# EAGLE design Doorbell (EAGLE 6.2)

## Sheet 1 of 7
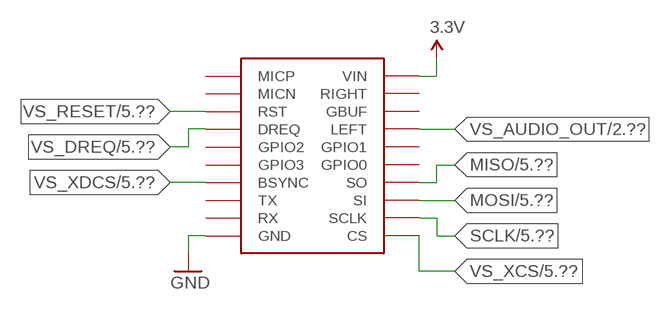
[diagram p0: schematic, sheet 1]

### Parts
U$3  VS1011E  [ADAFRUIT_1X10-BIG]

### Nets
3.3V: U$3.VIN ; also sheet 3,4,5,6,7
GND: U$3.GND ; also sheet 2,3,4,5,6,7
MISO: U$3.SO ; also sheet 5,6
MOSI: U$3.SI ; also sheet 5,6
SCLK: U$3.SCLK ; also sheet 5,6
VS_AUDIO_OUT: U$3.LEFT ; also sheet 2
VS_DREQ: U$3.DREQ ; also sheet 5
VS_RESET: U$3.RST ; also sheet 5
VS_XCS: U$3.CS ; also sheet 5
VS_XDCS: U$3.BSYNC ; also sheet 5
Unconnected: U$3.GBUF U$3.GPIO0 U$3.GPIO1 U$3.GPIO2 U$3.GPIO3 U$3.MICN U$3.MICP U$3.RIGHT U$3.RX U$3.TX

## Sheet 2 of 7
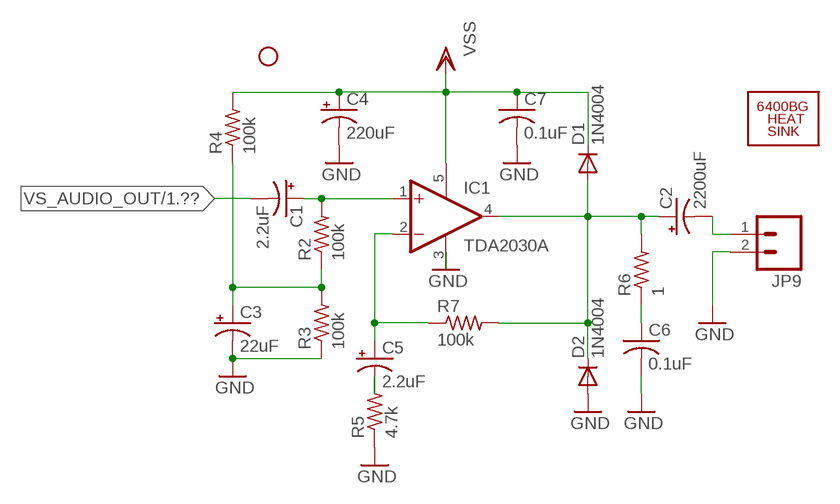
[diagram p1: schematic, sheet 2]

### Parts
C1  2.2uF  CPOL-USE2-5  [E2-5]
C2  2200uF  CPOL-USE7.5-16  [E7,5-16]
C3  22uF  CPOL-USE2-5  [E2-5]
C4  220uF  CPOL-USE5-10.5  [E5-10,5]
C5  2.2uF  CPOL-USE2-5  [E2-5]
C6  0.1uF  C-US025-030X050  [C025-030X050]
C7  0.1uF  C-US025-030X050  [C025-030X050]
D1  1N4004  [DO41-10]
D2  1N4004  [DO41-10]
IC1  TDA2030A  TDA2030V  [CB360]
JP7  STAND-OFF  [STAND-OFF]
JP9  M025MM  [SCREWTERMINAL-5MM-2]
R2  100k  R-US_0207/7  [0207/7]
R3  100k  R-US_0207/7  [0207/7]
R4  100k  R-US_0207/7  [0207/7]
R5  4.7k  R-US_0207/7  [0207/7]
R6  1  R-US_0207/7  [0207/7]
R7  100k  R-US_0207/7  [0207/7]
U$1  6400BG_HEATSINK  [6400BG_HEATSINK]

### Nets
GND: C3.- C4.- C6.2 C7.2 D2.A IC1.3(GND) JP9.2 R3.1 R5.1 ; also sheet 1,3,4,5,6,7
N$1: C6.1 R6.1
N$2: C2.+ D1.A D2.C IC1.4(OUT) R6.2 R7.2
N$3: C5.- R5.2
N$4: C5.+ IC1.2(-IN) R7.1
N$5: C1.+ IC1.1(+IN) R2.2
N$6: C3.+ R2.1 R3.2 R4.1
N$7: C2.- JP9.1
VS_AUDIO_OUT: C1.- ; also sheet 1
VSS: C4.+ C7.1 D1.C IC1.5(V+) R4.2 ; also sheet 3

## Sheet 3 of 7
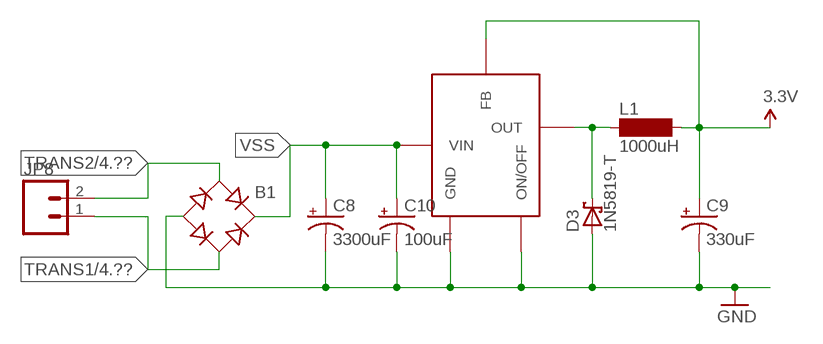
[diagram p2: schematic, sheet 3]

### Parts
B1  DBDB101G  [DB]
C8  3300uF  CPOL-USE7.5-18  [E7,5-18]
C9  330uF  CPOL-USE5-8.5  [E5-8,5]
C10  100uF  CPOL-USE5-8.5  [E5-8,5]
D3  1N5819-T  [DO41-7.6]
JP8  M025MM  [SCREWTERMINAL-5MM-2]
L1  1000uH  BS11  [BS11]
U$2  LM2575  [LINEAR-TECHNOLOGY_TO220-5]

### Nets
3.3V: C9.+ L1.2 U$2.FB ; also sheet 1,4,5,6,7
GND: B1.- C8.- C9.- C10.- D3.A U$2.GND U$2.ON/OFF ; also sheet 1,2,4,5,6,7
N$8: D3.C L1.1 U$2.OUT
TRANS1: B1.AC2 JP8.1 ; also sheet 4
TRANS2: B1.AC1 JP8.2 ; also sheet 4
VSS: B1.+ C8.+ C10.+ U$2.VIN ; also sheet 2

## Sheet 4 of 7
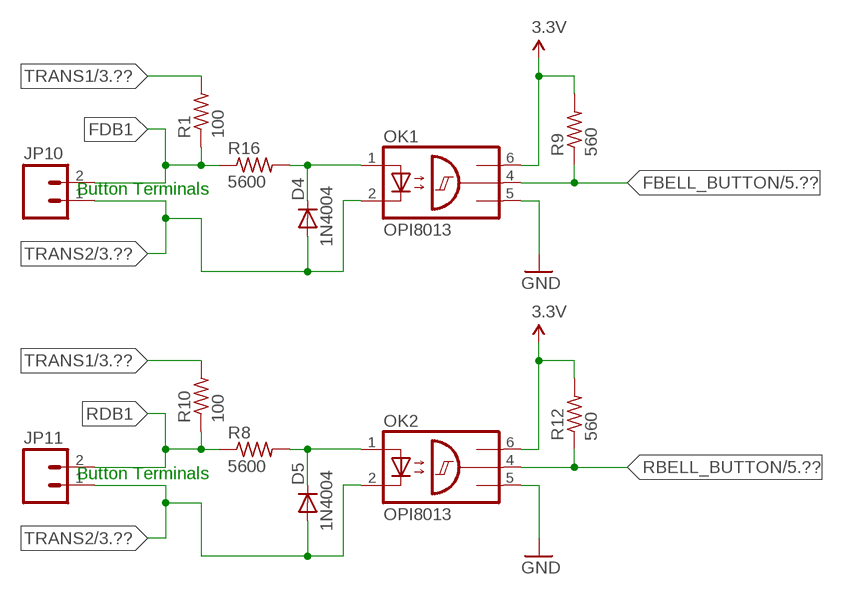
[diagram p3: schematic, sheet 4]

### Parts
D4  1N4004  [DO41-10]
D5  1N4004  [DO41-10]
JP10  M025MM  [SCREWTERMINAL-5MM-2]
JP11  M025MM  [SCREWTERMINAL-5MM-2]
OK1  OPI8013  [DIL06]
OK2  OPI8013  [DIL06]
R1  100  R-US_0817/22  [P0817/22]
R8  5600  R-US_0207/12  [0207/12]
R9  560  R-US_0207/7  [0207/7]
R10  100  R-US_0817/22  [P0817/22]
R12  560  R-US_0207/7  [0207/7]
R16  5600  R-US_0207/12  [0207/12]

### Nets
3.3V: OK1.6(VCC) OK2.6(VCC) R9.2 R12.2 ; also sheet 1,3,5,6,7
FBELL_BUTTON: OK1.4(OUT) R9.1 ; also sheet 5
FDB1: JP10.2 R1.1 R16.1
GND: OK1.5(GND) OK2.5(GND) ; also sheet 1,2,3,5,6,7
N$9: D4.C OK1.1(A) R16.2
N$10: D5.C OK2.1(A) R8.2
RBELL_BUTTON: OK2.4(OUT) R12.1 ; also sheet 5
RDB1: JP11.2 R8.1 R10.1
TRANS1: R1.2 R10.2 ; also sheet 3
TRANS2: D4.A D5.A JP10.1 JP11.1 OK1.2(C) OK2.2(C) ; also sheet 3

### Notes on the sheet
- Button Terminals
- Button Terminals

## Sheet 5 of 7
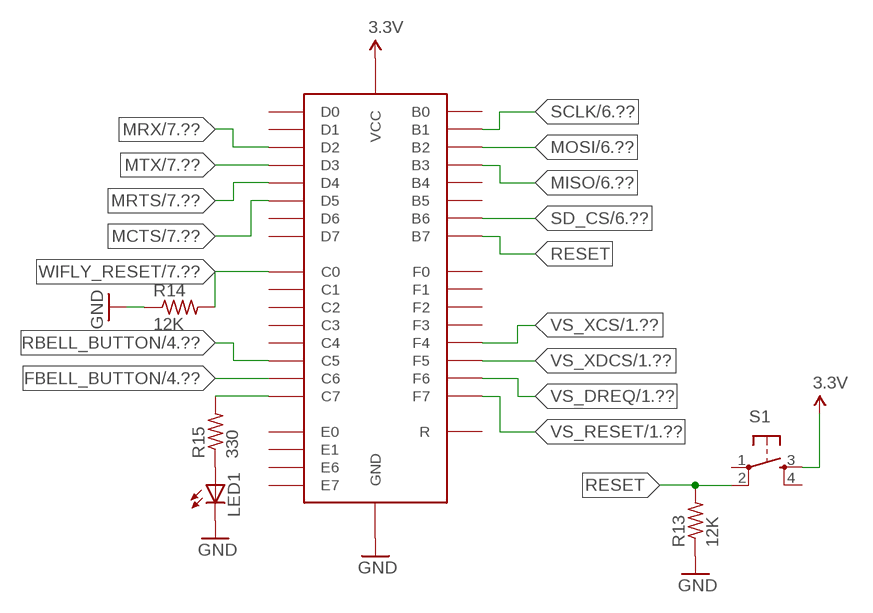
[diagram p4: schematic, sheet 5]

### Parts
LED1  LED3MM  [LED3MM]
R13  12K  R-US_0207/7  [0207/7]
R14  12K  R-US_0207/7  [0207/7]
R15  330  R-US_0207/7  [0207/7]
S1  TAC_SWITCHPTH  [TACTILE-PTH]
U$4  AT90USB1286AT90USB1286BREAKOUT  [ADAFRUIT_1X10-BIG]

### Nets
3.3V: S1.3 U$4.VCC ; also sheet 1,3,4,6,7
FBELL_BUTTON: U$4.C6 ; also sheet 4
GND: LED1.K(C) R13.1 R14.1 U$4.GND ; also sheet 1,2,3,4,6,7
MCTS: U$4.D5 ; also sheet 7
MISO: U$4.B3 ; also sheet 1,6
MOSI: U$4.B2 ; also sheet 1,6
MRTS: U$4.D4 ; also sheet 7
MRX: U$4.D2 ; also sheet 7
MTX: U$4.D3 ; also sheet 7
N$11: R15.2 U$4.C7
N$12: LED1.A R15.1
RBELL_BUTTON: U$4.C5 ; also sheet 4
RESET: R13.2 S1.2 U$4.B7
SCLK: U$4.B1 ; also sheet 1,6
SD_CS: U$4.B6 ; also sheet 6
VS_DREQ: U$4.F6 ; also sheet 1
VS_RESET: U$4.F7 ; also sheet 1
VS_XCS: U$4.F4 ; also sheet 1
VS_XDCS: U$4.F5 ; also sheet 1
WIFLY_RESET: R14.2 U$4.C0 ; also sheet 7
Unconnected: S1.1 S1.4 U$4.B0 U$4.B4 U$4.B5 U$4.C1 U$4.C2 U$4.C3 U$4.C4 U$4.D0 U$4.D1 U$4.D6 U$4.D7 U$4.E0 U$4.E1 U$4.E6 U$4.E7 U$4.F0 U$4.F1 U$4.F2 U$4.F3 U$4.R

## Sheet 6 of 7
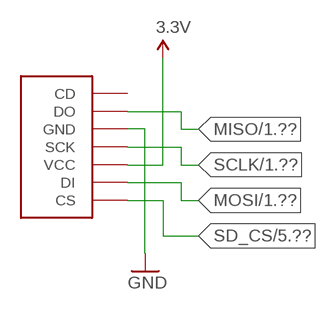
[diagram p5: schematic, sheet 6]

### Parts
U$5  MICROSDMICROSDBREAKOUT  [ADAFRUIT_1X08-BIG]

### Nets
3.3V: U$5.VCC ; also sheet 1,3,4,5,7
GND: U$5.GND ; also sheet 1,2,3,4,5,7
MISO: U$5.DO ; also sheet 1,5
MOSI: U$5.DI ; also sheet 1,5
SCLK: U$5.SCK ; also sheet 1,5
SD_CS: U$5.CS ; also sheet 5
Unconnected: U$5.CD

## Sheet 7 of 7
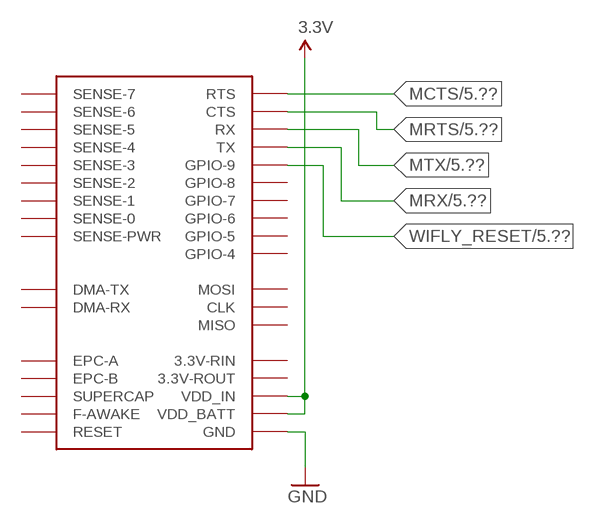
[diagram p6: schematic, sheet 7]

### Parts
U$6  WIFLY_BREAKOUT  [SPARKFUN_1X17]

### Nets
3.3V: U$6.VDD_BATT U$6.VDD_IN ; also sheet 1,3,4,5,6
GND: U$6.GND ; also sheet 1,2,3,4,5,6
MCTS: U$6.RTS ; also sheet 5
MRTS: U$6.CTS ; also sheet 5
MRX: U$6.TX ; also sheet 5
MTX: U$6.RX ; also sheet 5
WIFLY_RESET: U$6.GPIO-9 ; also sheet 5
Unconnected: U$6.3.3V-RIN U$6.3.3V-ROUT U$6.CLK U$6.DMA-RX U$6.DMA-TX U$6.EPC-A U$6.EPC-B U$6.F_AWAKE(F-AWAKE) U$6.GPIO-4 U$6.GPIO-5 U$6.GPIO-6 U$6.GPIO-7 U$6.GPIO-8 U$6.MISO U$6.MOSI U$6.RESET U$6.SENSE-0 U$6.SENSE-1 U$6.SENSE-2 U$6.SENSE-3 U$6.SENSE-4 U$6.SENSE-5 U$6.SENSE-6 U$6.SENSE-7 U$6.SENSE-PWR U$6.SUPERCAP

## Library data of the parts
B1 = rectifier:DB?*G: Single Phase 1.0 AMP Glass Passivated Bridge Rectifier Taiwan Semiconductor Co.,Ltd. - TSC Source: http://www.taiwansemi.com/TSCbig5/ezcatfiles/cust/img/img/db101g.pdf http://www.ts.com.tw/db/pictures/modules/PDT/PDT060207001/DBLS201G.pdf
C1-C5 C8-C10 = adafruit:CPOL-US: POLARIZED CAPACITOR, American symbol
C6 C7 = adafruit:C-US: CAPACITOR, American symbol
D1 D2 D4 D5 = adafruit:1N4004: DIODE General purpose 1N400x type rectifier (With bigger pads) http://www.ladyada.net/library/pcb/eaglelibrary.html
D3 = diode:1N581*: 1.0A SCHOTTKY BARRIER RECTIFIER Source: http://www.diodes.com/datasheets/ds23001.pdf
IC1 = Audio-Power-amlifier:TDA2030: Power OP AMP
JP7 = SparkFun-Electromechanical:STAND-OFF: #4 Stand Off This is the mechanical footprint for a #4 phillips button head screw. Use the keepout ring to avoid running the screw head into surrounding components. SKU : PRT-00447
JP8-JP11 = SparkFun-Connectors:M02: Header 2 Standard 2-pin 0.1" header. Use with straight break away headers (SKU : PRT-00116), right angle break away headers (PRT-00553), swiss pins (PRT-00743), machine pins (PRT-00117), and female headers (PRT-00115). Molex polarized connector foot print use with SKU : PRT-08233 with associated crimp pins and housings.
L1 = inductor-neosid:BS: INDUCTOR nominal inductance, magnetically screened; OC_FARNELL: unknown; OC_NEWARK: unknown
LED1 = led:LED: LED OSRAM: - CHIPLED LG R971, LG N971, LY N971, LG Q971, LY Q971, LO R971, LY R971 LH N974, LH R974 LS Q976, LO Q976, LY Q976 LO Q996 - Hyper CHIPLED LW Q18S LB Q993, LB Q99A, LB R99A - SideLED LS A670, LO A670, LY A670, LG A670, LP A670 LB A673, LV A673, LT A673, LW A673 LH A674 LY A675 LS A676, LA A676, LO A676, LY A676, LW A676 LS A679, LY A679, LG A679 - Hyper Micro SIDELED® LS Y876, LA Y876, LO Y876, LY Y876 LT Y87S - SmartLED LW L88C, LW L88S LB L89C, LB L89S, LG L890 LS L89K, LO L89K, LY L89K LS L896, LA L896, LO L896, LY L896 - TOPLED LS T670, LO T670, LY T670, LG T670, LP T670 LSG T670, LSP T670, LSY T670, LOP T670, LYG T670 LG T671, LOG T671, LSG T671 LB T673, LV T673, LT T673, LW T673 LH T674 LS T676, LA T676, LO T676, LY T676, LB T676, LH T676, LSB T676, LW T676 LB T67C, LV T67C, LT T67C, LS T67K, LO T67K, LY T67K, LW E67C LS E67B, LA E67B, LO E67B, LY E67B, LB E67C, LV E67C, LT E67C LW T67C LS T679, LY T679, LG T679 LS T770, LO T770, LY T770, LG T770, LP T770 LB T773, LV T773, LT T773, LW T773 LH T774 LS E675, LA E675, LY E675, LS T675 LS T776, LA T776, LO T776, LY T776, LB T776 LHGB T686 LT T68C, LB T68C - Hyper Mini TOPLED® LB M676 - Mini TOPLED Santana® LG M470 LS M47K, LO M47K, LY M47K Source: http://www.osram.convergy.de LUXEON: - LUMILED® LXK2-PW12-R00, LXK2-PW12-S00, LXK2-PW14-U00, LXK2-PW14-V00 LXK2-PM12-R00, LXK2-PM12-S00, LXK2-PM14-U00 LXK2-PE12-Q00, LXK2-PE12-R00, LXK2-PE12-S00, LXK2-PE14-T00, LXK2-PE14-U00 LXK2-PB12-K00, LXK2-PB12-L00, LXK2-PB12-M00, LXK2-PB14-N00, LXK2-PB14-P00, LXK2-PB14-Q00 LXK2-PR12-L00, LXK2-PR12-M00, LXK2-PR14-Q00, LXK2-PR14-R00 LXK2-PD12-Q00, LXK2-PD12-R00, LXK2-PD12-S00 LXK2-PH12-R00, LXK2-PH12-S00 LXK2-PL12-P00, LXK2-PL12-Q00, LXK2-PL12-R00 Source: www.luxeon.com KINGBRIGHT: KA-3528ASYC Source: www.kingbright.com
OK1 OK2 = optocoupler:OPI8013: OPTO COUPLER; OC_FARNELL: unknown; OC_NEWARK: unknown
R1-R7 R9 R10 R12 = adafruit:R-US_: RESISTOR, American symbol
R8 R13-R16 = resistor:R-US_: RESISTOR, American symbol
S1 = SparkFun-Electromechanical:TAC_SWITCH: Momentary Switch Button commonly used for reset or general input. Spark Fun Electronics SKU : COM-00097
U$1 = SparkFun-Electromechanical:6400BG_HEATSINK: Multiwatt heatsink, PRT-09576
U$2 = LM2575:LM2575
U$3 = VS1011E:VS1011E
U$4 = AT90USB1286:AT90USB1286
U$5 = MicroSD:MICROSD
U$6 = WiFly_Breakout:WIFLY_BREAKOUT: WiFly Breakout

## Net classes
0 default: clearance 0.254 mm

## Board
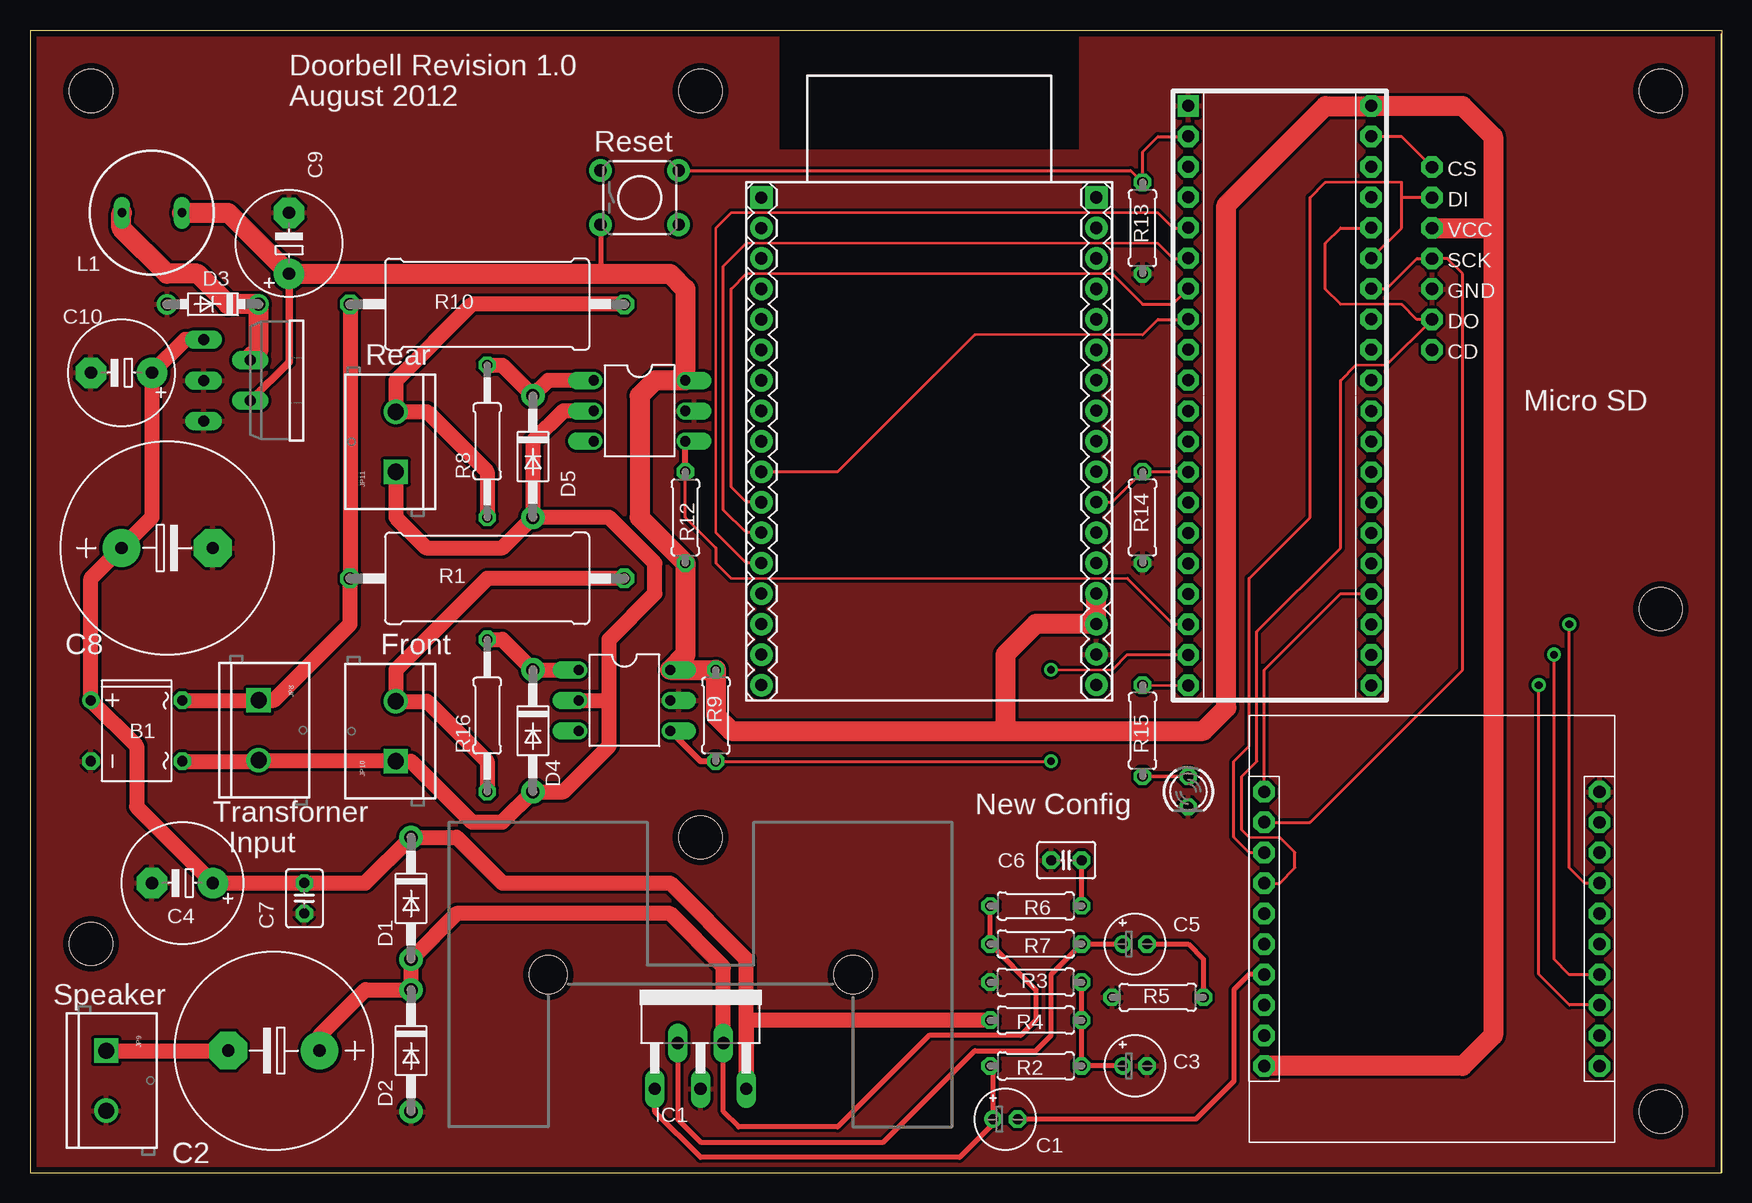
[diagram p7: board, top side]
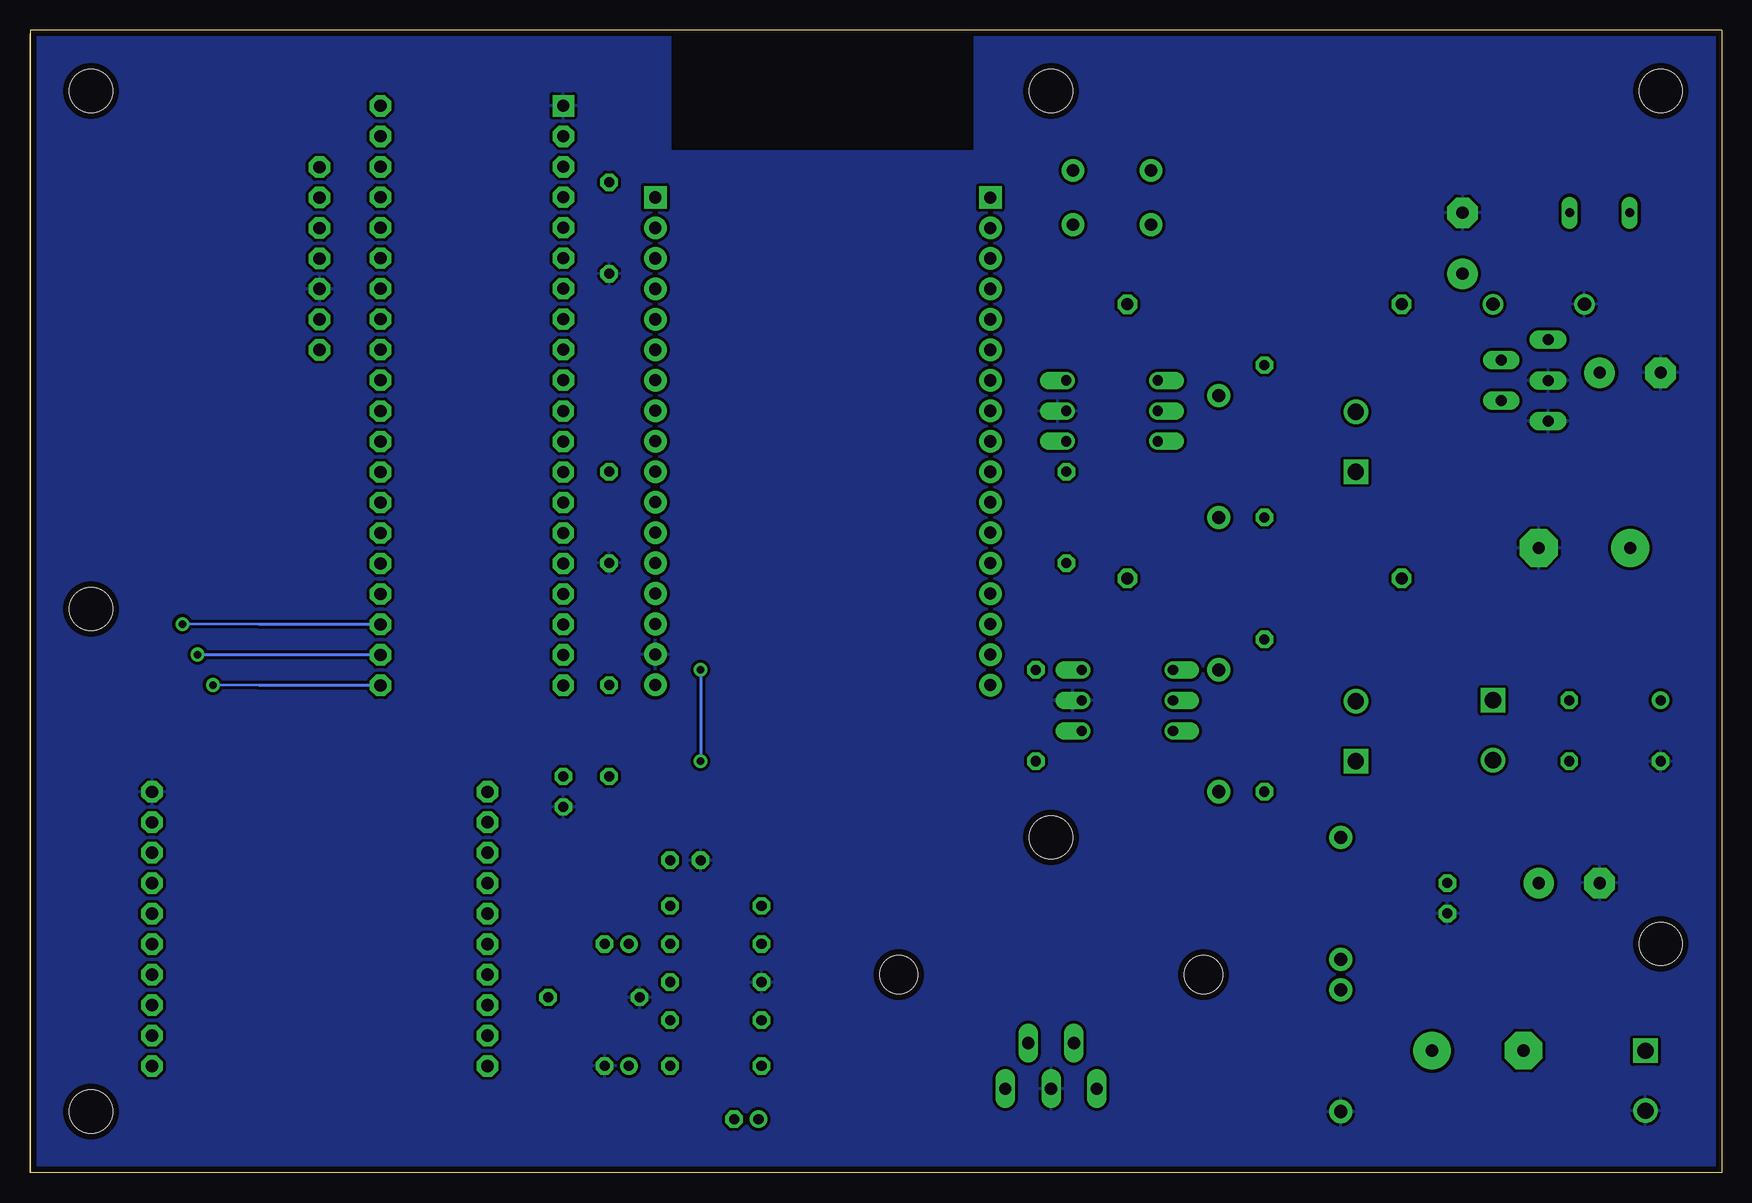
[diagram p8: board, bottom side, seen from below]

Size 140.97 x 95.25 mm. Coordinates in mm from the lower left corner, seen from the top.
Outline: 140.95,0 0,0 0,95.25 140.97,95.25 140.97,0 140.95,0
Outline: 140.95,0 140.95,94.92
Copper layers (1*16): Top 0.0178mm / dielectric 59mil / Bottom 0.0178mm
Design rules: minimum track width 6mil, minimum drill 20mil, track to track 6mil, track to pad 6mil, pad to pad 6mil, via to via 6mil, smd to smd 6mil, copper to edge 20mil, drill to drill 16mil, minimum pad ring 12mil, minimum via ring 10mil, stop-mask expansion 3mil, vias tented up to drill 0mil, thermal gap 10mil

### Footprints (pad centres in the part's own frame; a part is rotated, then mirrored left to right if it is on the bottom)
DB = drill 0.838: + -2.54,-3.81 | drill 0.838 octagon: - 2.54,-3.81; AC1 2.54,3.81; AC2 -2.54,3.81
E2-5 = drill 0.838 pad 1.422: + -1.016,0 | drill 0.838 pad 1.422 octagon: - 1.016,0
E7,5-16 = drill 1.016 pad 3.15: + -3.81,0 | drill 1.016 pad 3.15 octagon: - 3.81,0
E5-10,5 = drill 1.016 pad 2.54: + -2.54,0 | drill 1.016 pad 2.54 octagon: - 2.54,0
C025-030X050 = drill 0.838 pad 1.422 octagon: 1 -1.27,0; 2 1.27,0
E7,5-18 = drill 1.016 pad 3.15: + -3.81,0 | drill 1.016 pad 3.15 octagon: - 3.81,0
E5-8,5 = drill 1.016 pad 2.54: + -2.54,0 | drill 1.016 pad 2.54 octagon: - 2.54,0
DO41-10 = drill 1.092 pad 1.93: A 5.08,0; C -5.08,0
DO41-7.6 = drill 1.1 pad 1.7: A 3.81,0; C -3.81,0
CB360 = drill 1.016 long: 1 -3.81,-8.255; 2 -1.905,-4.445; 3 0,-8.255; 4 1.905,-4.445; 5 3.81,-8.255
STAND-OFF = hole 3.581: 0,0
SCREWTERMINAL-5MM-2 = drill 1.346 pad 2.032 square: 1 0,0 | drill 1.346 pad 2.032: 2 5,0
BS11 = drill 0.737 long: 1 -2.5,0; 2 2.5,0
LED3MM = drill 0.838 octagon: A -1.27,0; K 1.27,0
DIL06 = drill 0.838 offset: 1 -2.54,-3.81; 2 0,-3.81; 3 2.54,-3.81; 4 2.54,3.81; 5 0,3.81; 6 -2.54,3.81
P0817/22 = drill 1.016 octagon: 1 -11.43,0; 2 11.43,0
0207/7 = drill 0.838 octagon: 1 -3.81,0; 2 3.81,0
0207/12 = drill 0.838 octagon: 1 -6.35,0; 2 6.35,0
TACTILE-PTH = drill 1.016 pad 1.88: 1 -3.251,2.261; 2 3.251,2.261; 3 -3.251,-2.261; 4 3.251,-2.261
6400BG_HEATSINK = hole 3.175: -12.7,0; 12.7,0
LINEAR-TECHNOLOGY_TO220-5 = drill 0.914 long: FB 1.7,-4.5; GND 0,-8.4; ON/OFF 3.4,-8.4; OUT -1.7,-4.5; VIN -3.4,-8.4
ADAFRUIT_1X10-BIG = drill 1.016 pad 1.778 octagon: BSYNC 1.283,13.98; CS 29.234,6.359; DREQ 1.283,21.6; GBUF 29.234,24.139; GND 1.283,6.36; GPIO0 29.234,16.519; GPIO1 29.234,19.059; GPIO2 1.283,19.06; GPIO3 1.283,16.52; LEFT 29.234,21.599; MICN 1.283,26.68; MICP 1.283,29.22; RIGHT 29.234,26.679; RST 1.283,24.14; RX 1.283,8.9; SCLK 29.234,8.899; SI 29.234,11.439; SO 29.234,13.979; TX 1.283,11.44; VIN 29.234,29.219
ADAFRUIT_1X10-BIG' = drill 1.016 pad 1.778 octagon: B0 16.514,31.776; B1 16.514,34.316; B2 16.514,36.856; B3 16.514,39.396; B4 16.514,41.936; B5 16.514,44.476; B6 16.514,47.016; B7 1.274,47.016; C0 1.277,19.026; C1 1.277,16.486; C2 1.277,13.946; C3 1.277,11.406; C4 1.277,8.866; C5 1.277,6.326; C6 1.277,3.786; C7 1.277,1.246; D0 1.274,44.476; D1 1.274,41.936; D2 1.274,39.396; D3 1.274,36.856; D4 1.274,34.316; D5 1.274,31.776; D6 1.274,29.236; D7 1.274,26.696; E0 1.277,24.106; E1 1.277,21.566; E6 16.514,26.696; E7 16.514,29.236; F0 16.517,19.026; F1 16.517,16.486; F2 16.517,13.946; F3 16.517,11.406; F4 16.517,8.866; F5 16.517,6.326; F6 16.517,3.786; F7 16.517,1.246; GND1 16.517,24.106; R 16.517,21.566; VCC 16.514,49.556 | drill 1.016 pad 1.778 square: GND 1.274,49.556
ADAFRUIT_1X08-BIG = drill 1.016 pad 1.778 octagon: CD 17.78,1.27; CS 2.54,1.27; DI 5.08,1.27; DO 15.24,1.27; GND 12.7,1.27; SCK 10.16,1.27; VCC 7.62,1.27
SPARKFUN_1X17 = drill 1.016 pad 1.88: 3.3V-RIN 29.17,1.281; 3.3V-ROUT 1.25,1.272; CLK 1.25,6.352; CTS 1.25,16.512; DMA-RX 29.17,13.981; DMA-TX 29.17,11.441; EPC-A 1.25,29.212; EPC-B 1.25,26.672; F_AWAKE 1.25,21.592; GND 29.17,3.821; GPIO-4 29.17,29.221; GPIO-5 29.17,26.681; GPIO-6 29.17,24.141; GPIO-7 29.17,21.601; GPIO-8 29.17,19.061; GPIO-9 29.17,16.521; MISO 1.25,3.812; MOSI 1.25,8.892; RESET 1.25,31.752; RTS 1.25,19.052; RX 1.25,13.972; SENSE-1 29.17,31.761; SENSE-2 29.17,34.301; SENSE-3 29.17,36.841; SENSE-4 1.25,39.372; SENSE-5 1.25,36.832; SENSE-7 1.25,34.292; SENSE-PWR 29.17,39.381; SUPERCAP 1.25,24.132; TX 1.25,11.432; VDD_BATT 29.17,6.361; VDD_IN 29.17,8.901 | drill 1.016 pad 1.88 square: SENSE-0 29.17,41.921; SENSE-6 1.25,41.912

### Placement (x,y rotation side)
B1  8.89,36.83 270 top
C1  81.28,4.45 0 top
C2  20.32,10.16 180 top
C3  92.08,8.89 0 top
C4  12.7,24.13 180 top
C5  92.08,19.05 0 top
C6  86.36,26.04 180 top
C7  22.86,22.86 270 top
C8  11.43,52.07 0 top
C9  21.59,77.47 90 top
C10  7.62,66.67 180 top
D1  31.75,22.86 270 top
D2  31.75,10.16 270 top
D3  15.24,72.39 180 top
D4  41.91,36.83 270 top
D5  41.91,59.69 270 top
IC1  55.88,15.24 0 top
JP1  STAND-OFF  [STAND-OFF]  5.08,90.17 0 top
JP2  STAND-OFF  [STAND-OFF]  55.88,90.17 0 top
JP3  STAND-OFF  [STAND-OFF]  5.08,19.05 0 top
JP4  STAND-OFF  [STAND-OFF]  55.88,27.94 0 top
JP5  STAND-OFF  [STAND-OFF]  135.89,5.08 0 top
JP6  STAND-OFF  [STAND-OFF]  135.89,46.99 0 top
JP7  135.89,90.17 0 top
JP8  19.05,39.37 270 top
JP9  6.35,10.16 270 top
JP10  30.48,34.29 90 top
JP11  30.48,58.42 90 top
L1  10.16,80.01 0 top
LED1  96.52,31.75 270 top
OK1  49.53,39.37 270 top
OK2  50.8,63.5 270 top
R1  38.1,49.53 180 top
R2  83.82,8.89 180 top
R3  83.82,15.88 0 top
R4  83.82,12.7 180 top
R5  93.98,14.61 0 top
R6  83.82,22.23 180 top
R7  83.82,19.05 180 top
R8  38.1,60.96 90 top
R9  57.15,38.1 90 top
R10  38.1,72.39 180 top
R12  54.61,54.61 270 top
R13  92.71,78.74 90 top
R14  92.71,54.61 90 top
R15  92.71,36.83 90 top
R16  38.1,38.1 90 top
S1  50.8,81.28 0 top
U$1  55.88,16.51 0 top
U$2  22.86,66.04 270 top
U$3  132.08,38.1 180 top
U$4  AT90USB1286AT90USB1286BREAKOUT  [ADAFRUIT_1X10-BIG']  95.25,39.37 0 top
U$5  115.57,86.36 270 top
U$6  59.69,39.37 0 top

### Tracks (layer width: path | path; a pad name or v marks a point on that pad's centre or on a via)
3.3V
  Top 0.406: S1.3 47.55,75.64 48.26,74.93
  Top 0.61: C9.+ 21.59,67.57 U$2.FB
  Top 1.676: L1.2 16.51,80.01 C9.+ 48.26,74.93 53.34,74.93 54.61,73.66 OK2.6 52.07,66.04 50.8,64.77 50.8,54.61 R12.2 54.61,43.18 OK1.6 R9.2 57.15,38.1 58.42,36.83 81.28,36.83 | U$6.VDD_BATT | 81.28,36.83 97.79,36.83 99.69,38.73 99.69,80.64 107.95,88.9 111.74,88.9 U$4.VCC 119.35,88.93 121.92,86.36 121.92,78.74 | U$6.VDD_BATT 83.83,45.73 81.28,43.18 81.28,36.83 | U$6.VDD_BATT U$6.VDD_IN | 121.92,78.74 121.92,11.43 119.38,8.89 U$3.VIN | U$5.VCC 121.92,78.74
FBELL_BUTTON  (via drill 0.64)
  Top 0.203: 90.17,41.91 v85.09,41.91
  Top 0.254: U$4.C6 91.46,43.16 91.44,43.18 90.17,41.91 | R9.1 v85.09,34.29
  Top 0.508: R9.1 55.88,34.29 OK1.4
  Bottom 0.254: v85.09,41.91 v85.09,34.29
FDB1
  Top 1.27: R1.1 38.1,49.53 30.48,41.91 JP10.2 33.1,39.29 38.1,34.29 R16.1
GND
  pour Bottom: -1.27,96.52 62.23,96.52 62.23,85.09 87.63,85.09 87.63,96.52 142.24,96.52 142.24,-1.27 -1.27,-1.27
  pour Top: -1.27,96.52 62.23,96.52 62.23,85.09 87.63,85.09 87.63,96.52 142.24,96.52 142.24,-1.27 -1.27,-1.27
MCTS
  Top 0.203: 78.74,69.85 92.71,69.85
  Top 0.254: U$6.RTS 67.31,58.42 78.74,69.85 | 92.71,69.85 93.98,71.12 96.5,71.12 U$4.D5
MISO
  Top 0.203: 114.3,72.39 109.22,72.39 | 104.14,27.94 101.6,27.94 | 110.49,67.31 113.03,67.31
  Top 0.254: 109.22,72.39 107.95,73.66 107.95,77.47 109.22,78.74 111.74,78.74 U$4.B3 | U$3.SO 104.13,24.12 105.41,25.4 105.41,26.67 104.14,27.94 | 101.6,27.94 100.97,28.57 100.97,33.02 102.23,34.29 102.23,45.09 109.22,52.07 109.22,66.04 110.49,67.31 | 113.03,67.31 U$5.DO 115.57,71.12 114.3,72.39
MOSI
  Top 0.203: 107.95,82.55 114.3,82.55
  Top 0.254: U$4.B2 111.79,76.23 114.3,78.74 114.3,81.28 | 114.3,81.28 114.3,82.55 | U$3.SI 101.61,26.66 100.33,27.94 100.33,34.29 101.6,35.56 101.6,49.53 106.68,54.61 106.68,81.28 107.95,82.55 | U$5.DI 114.3,81.28
MRTS
  Top 0.203: 59.69,74.93 90.17,74.93
  Top 0.254: U$6.CTS 59.69,55.88 58.42,57.15 58.42,73.66 59.69,74.93 | 90.17,74.93 92.71,72.39 95.23,72.39 U$4.D4
MRX
  Top 0.203: 57.15,53.34 57.15,78.74 | 58.42,80.01 93.98,80.01
  Top 0.254: U$6.TX 59.69,50.8 57.15,53.34 | 57.15,78.74 58.42,80.01 | 93.98,80.01 95.25,78.74 96.5,78.74 U$4.D2
MTX
  Top 0.203: 59.69,77.47 93.98,77.47
  Top 0.254: U$6.RX 59.69,53.34 57.78,55.24 57.78,75.56 59.69,77.47 | 93.98,77.47 95.25,76.2 96.5,76.2 U$4.D3
N$1
  Top 0.406: R6.1 C6.1
N$2
  Top 0.406: IC1.4 57.78,5.08 59.05,3.81 67.31,3.81 74.93,11.43 82.55,11.43 83.82,12.7 83.82,15.24 R7.2 R6.2
  Top 1.27: IC1.4 57.78,17.14 53.34,21.59 35.56,21.59 D1.A D2.C 27.94,15.24 24.13,11.43 C2.+
N$3
  Top 0.406: C5.- 96.52,19.05 97.79,17.78 R5.2
N$4
  Top 0.406: C5.+ R7.1 85.09,16.51 85.09,11.43 83.82,10.16 78.74,10.16 71.12,2.54 55.88,2.54 53.98,4.45 IC1.2
N$5
  Top 0.406: IC1.1 52.07,5.08 55.88,1.27 77.47,1.27 80.26,4.06 C1.+ 80.26,8.64 R2.2
N$6
  Top 0.406: C3.+ R2.1 R4.1 R3.2
N$7
  Top 1.27: 15.84,9.48 C2.- JP9.1
N$8
  Top 1.27: L1.1 7.62,80.01
  Top 1.676: U$2.OUT 18.36,67.89 19.05,68.58 D3.C 16.51,72.39 13.97,74.93 11.43,74.93 7.62,78.74 7.62,79.97 L1.1
N$9
  Top 1.27: OK1.1 D4.C 39.37,44.45 R16.2
N$10
  Top 1.27: OK2.1 43.18,66.04 D5.C 39.37,67.31 R8.2
N$11
  Top 0.254: R15.2 U$4.C7
N$12
  Top 0.305: LED1.A R15.1
RBELL_BUTTON
  Top 0.203: 58.42,49.53 91.44,49.53
  Top 0.254: U$4.C5 95.27,45.7 91.44,49.53 | R12.1 54.61,54.61 57.15,52.07 57.15,50.8 58.42,49.53
  Top 0.508: R12.1 OK2.4
RDB1
  Top 1.27: R10.1 36.83,72.39 30.48,66.04 JP11.2 33.1,63.42 38.1,58.42 R8.1
RESET
  Top 0.254: U$4.B7 96.5,86.36 93.98,86.36 92.71,85.09 R13.2 91.72,83.54 S1.2
SCLK
  Top 0.254: U$3.SCLK 106.67,29.2 119.38,41.91 119.38,74.93 118.11,76.2 U$5.SCK 115.57,76.2 113.06,73.69 U$4.B1
SD_CS
  Top 0.254: U$5.CS 114.3,86.36 111.79,86.36 U$4.B6
TRANS1
  Top 1.27: R10.2 R1.2 26.67,45.72 20.32,39.37 JP8.1 B1.AC2
TRANS2
  Top 1.27: B1.AC1 18.97,34.29 JP8.2 30.4,34.37 JP10.1 31.75,34.29 36.83,29.21 39.37,29.21 D4.A 44.45,31.75 48.26,35.56 48.26,39.37 | JP11.1 30.48,54.61 33.02,52.07 39.37,52.07 D5.A | 48.26,39.37 48.26,44.45 52.07,48.26 52.07,50.8 48.26,54.61 D5.A | OK1.2 48.26,39.37 | OK2.2 44.45,63.5 41.91,60.96 D5.A
VS_AUDIO_OUT
  Top 0.406: U$3.LEFT 101.59,16.5 100.33,15.24 100.33,7.62 97.16,4.45 C1.-
VS_DREQ  (via drill 0.64)
  Top 0.254: U$3.DREQ 128.28,16.5 127,17.78 v127,43.18
  Bottom 0.254: U$4.F6 126.98,43.16 v127,43.18
VS_RESET  (via drill 0.64)
  Top 0.254: U$3.RST 128.28,13.96 125.73,16.51 v125.73,40.64
  Bottom 0.254: U$4.F7 121.9,40.62 v125.73,40.64
VS_XCS
  Top 0.254: U$3.CS 102.85,41.89 109.22,48.26 111.74,48.26 U$4.F4
VS_XDCS  (via drill 0.64)
  Top 0.254: U$3.BSYNC 129.55,24.12 128.27,25.4 v128.27,45.72
  Bottom 0.254: U$4.F5 121.9,45.7 v128.27,45.72
VSS
  Top 1.27: R4.2 59.69,12.7 IC1.5 59.69,17.78 53.34,24.13 39.37,24.13 35.56,27.94 D1.C 27.94,24.13 C7.1 C4.+ 8.89,30.48 8.89,35.56 B1.+ 5.08,49.53 C8.+ 10.16,54.61 C10.+ 12.93,69.44 U$2.VIN
WIFLY_RESET
  Top 0.254: U$6.GPIO-9 90.18,55.89 R14.2 96.5,58.42 U$4.C0

### Text on the board
tPlace: Reset | Rear | Micro SD | Front | New Config | Transforner | Input | Speaker
tNames: Doorbell Revision 1.0 | August 2012